# EAGLE design scheme (EAGLE 5.10)
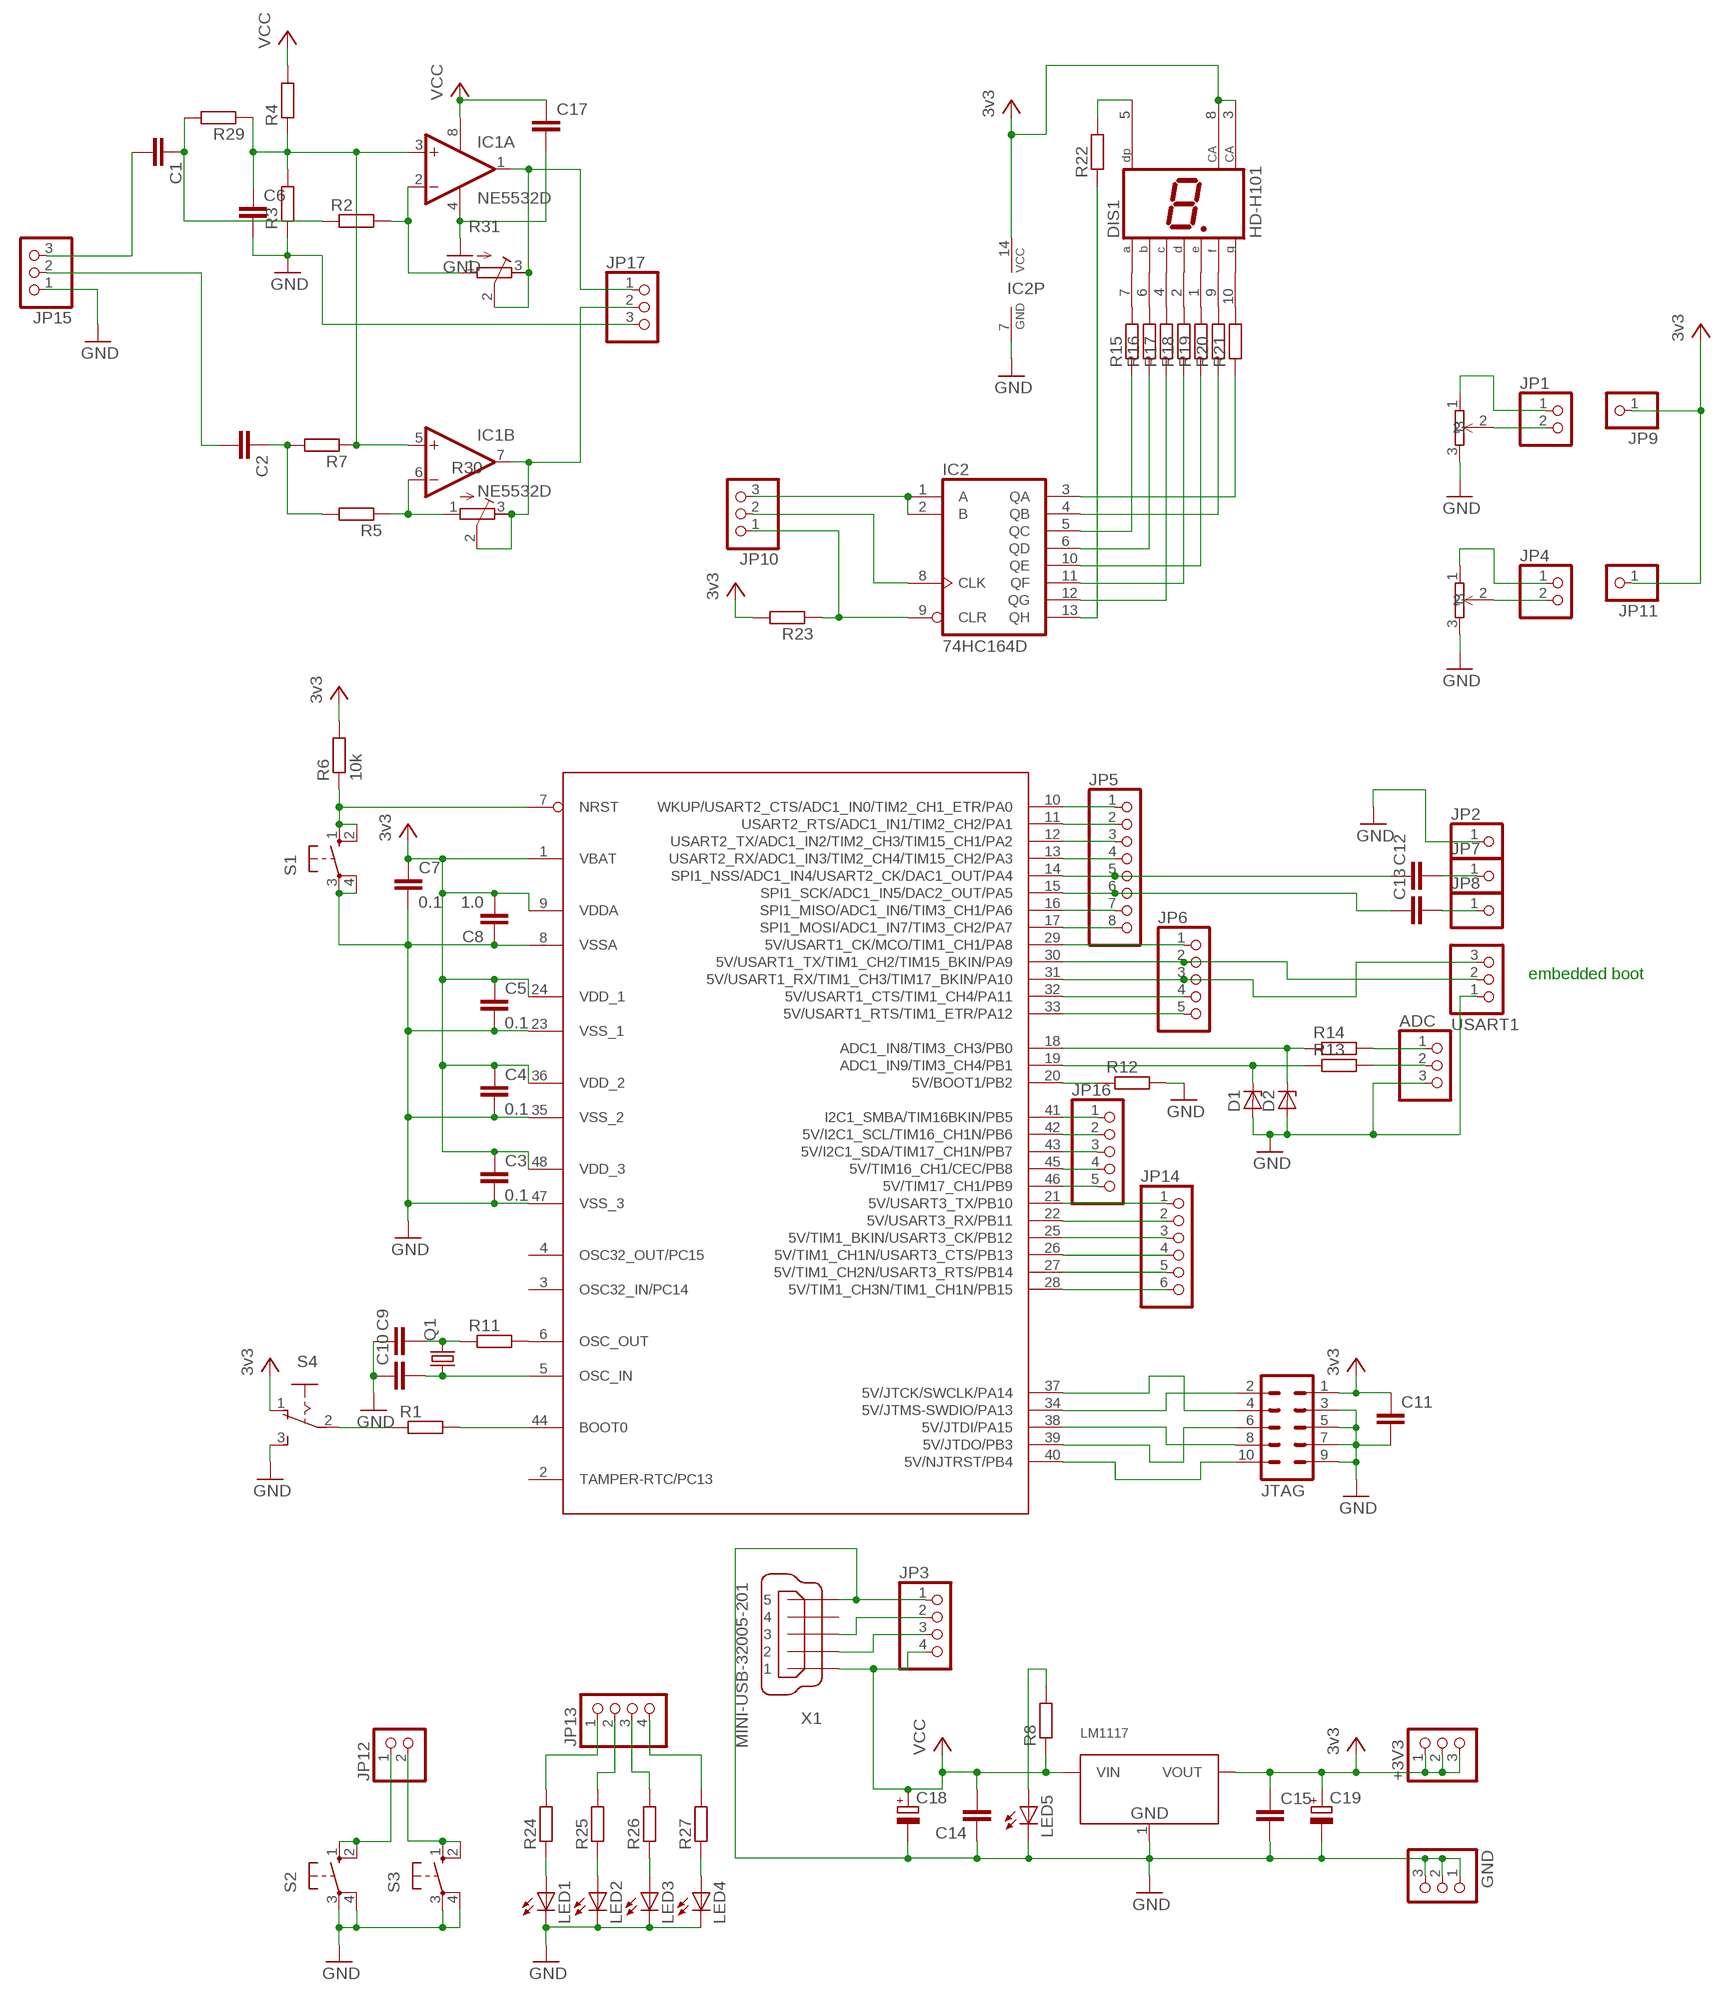
[diagram p0: schematic, sheet 1]

## Parts
+3V3  PINHD-1X3  [1X03]
ADC  PINHD-1X3  [1X03]
C1  C-EUC0805  [C0805]
C2  C-EUC0805  [C0805]
C3  0.1  C-EUC0805  [C0805]
C4  0.1  C-EUC0805  [C0805]
C5  0.1  C-EUC0805  [C0805]
C6  C-EUC0805  [C0805]
C7  0.1  C-EUC0805  [C0805]
C8  1.0  C-EUC1206  [C1206]
C9  C-EUC0805  [C0805]
C10  C-EUC0805  [C0805]
C11  C-EUC0805  [C0805]
C12  C-EUC0805  [C0805]
C13  C-EUC0805  [C0805]
C14  C-EUC1206  [C1206]
C15  C-EUC0805  [C0805]
C17  C-EUC0805  [C0805]
C18  CPOL-EUE2,5-6E  [E2,5-6E]
C19  CPOL-EUE2,5-6E  [E2,5-6E]
D1  ZENER-DIODEDO34-7  [DO34Z7]
D2  ZENER-DIODEDO34-7  [DO34Z7]
DIS1  HD-H101  [HDSP-M]
GND  PINHD-1X3  [1X03]
IC1  NE5532D  [SO08]
IC2  74HC164D  [SO14]
JP1  PINHD-1X2  [1X02]
JP2  PINHD-1X1  [1X01]
JP3  PINHD-1X4  [1X04]
JP4  PINHD-1X2  [1X02]
JP5  PINHD-1X8  [1X08]
JP6  PINHD-1X5  [1X05]
JP7  PINHD-1X1  [1X01]
JP8  PINHD-1X1  [1X01]
JP9  PINHD-1X1  [1X01]
JP10  PINHD-1X3  [1X03]
JP11  PINHD-1X1  [1X01]
JP12  PINHD-1X2  [1X02]
JP13  PINHD-1X4  [1X04]
JP14  PINHD-1X6  [1X06]
JP15  PINHD-1X3  [1X03]
JP16  PINHD-1X5  [1X05]
JP17  PINHD-1X3  [1X03]
JTAG  ML10  [ML10]
LED1  LEDCHIPLED_0805  [CHIPLED_0805]
LED2  LEDCHIPLED_0805  [CHIPLED_0805]
LED3  LEDCHIPLED_0805  [CHIPLED_0805]
LED4  LEDCHIPLED_0805  [CHIPLED_0805]
LED5  LEDCHIPLED_0805  [CHIPLED_0805]
LM1117  LD1117-3.3SOT223  [SOT223]
Q1  CRYSTALHC49U70  [HC49U70]
R1  R-EU_R0805  [R0805]
R2  R-EU_R0805  [R0805]
R3  R-EU_R0805  [R0805]
R4  R-EU_R0805  [R0805]
R5  R-EU_R0805  [R0805]
R6  10k  R-EU_R0805  [R0805]
R7  R-EU_R0805  [R0805]
R8  R-EU_R0805  [R0805]
R11  R-EU_R0805  [R0805]
R12  R-EU_R0805  [R0805]
R13  R-EU_R0805  [R0805]
R14  R-EU_R0805  [R0805]
R15  R-EU_R0805  [R0805]
R16  R-EU_R0805  [R0805]
R17  R-EU_R0805  [R0805]
R18  R-EU_R0805  [R0805]
R19  R-EU_R0805  [R0805]
R20  R-EU_R0805  [R0805]
R21  R-EU_R0805  [R0805]
R22  R-EU_R0805  [R0805]
R23  R-EU_R0805  [R0805]
R24  R-EU_R0805  [R0805]
R25  R-EU_R0805  [R0805]
R26  R-EU_R0805  [R0805]
R27  R-EU_R0805  [R0805]
R29  R-EU_R0805  [R0805]
R30  R-TRIMM64W  [RTRIM64W]
R31  R-TRIMM64W  [RTRIM64W]
S1  10-XX  [B3F-10XX]
S2  10-XX  [B3F-10XX]
S3  10-XX  [B3F-10XX]
S4  M251  [M251]
U$1  STM32F100C4T6  [LQFP48]
U$2  POT1  [POT1]
U$3  POT1  [POT1]
USART1  PINHD-1X3  [1X03]
X1  MINI-USB-32005-201  [32005-201]

## Nets
3V3: +3V3.1 +3V3.2 +3V3.3 C3.1 C4.1 C5.1 C7.1 C8.2 C11.1 C15.1 C19.+ DIS1.3(CA) DIS1.8(CA) IC2.14(VCC) JP9.1 JP11.1 JTAG.1 LM1117.2(VOUT) R6.2 R23.2 S4.1(O) U$1.1(VBAT) U$1.9(VDDA) U$1.24(VDD_1) U$1.36(VDD_2) U$1.48(VDD_3) ; supply symbol labelled 3v3
GND: ADC.3 C3.2 C4.2 C5.2 C6.2 C7.2 C8.1 C9.1 C10.1 C11.2 C14.1 C15.2 C17.2 C18.- C19.- D1.A D2.A GND.1 GND.2 GND.3 IC1.4(P:V-) IC2.7(GND) JP2.1 JP3.1 JP15.1 JP17.3 JTAG.3 JTAG.5 JTAG.7 JTAG.9 LED1.C LED2.C LED3.C LED4.C LED5.C LM1117.1(GND) R3.1 R12.2 S1.3(P) S1.4(P1) S2.3(P) S2.4(P1) S3.3(P) S3.4(P1) S4.3(S) U$1.8(VSSA) U$1.23(VSS_1) U$1.35(VSS_2) U$1.47(VSS_3) U$2.3 U$3.3 USART1.1 X1.5
N$1: C6.1 IC1.3(A:+IN) IC1.5(B:+IN) R3.2 R4.1 R7.1 R29.1
N$2: IC1.2(A:-IN) R2.2 R31.1(E)
N$3: IC1.1(A:OUT) JP17.1 R31.2(S) R31.3(A)
N$4: R11.2 U$1.6(OSC_OUT)
N$5: C2.1 R5.2 R7.2
N$6: IC1.6(B:-IN) R5.1 R30.1(E)
N$7: IC1.7(B:OUT) JP17.2 R30.2(S) R30.3(A)
N$8: R6.1 S1.1(S) S1.2(S1) U$1.7(NRST)
N$9: C10.2 Q1.1 U$1.5(OSC_IN)
N$10: C9.2 Q1.2 R11.1
N$11: C1.2 JP15.3
N$12: C2.2 JP15.2
N$13: R1.1 S4.2(P)
N$14: C13.2 JP8.1
N$15: R12.1 U$1.20(5V/BOOT1/PB2)
N$16: R1.2 U$1.44(BOOT0)
N$17: JTAG.2 U$1.34(5V/JTMS-SWDIO/PA13)
N$18: JTAG.4 U$1.37(5V/JTCK/SWCLK/PA14)
N$19: JTAG.8 U$1.38(5V/JTDI/PA15)
N$20: JTAG.6 U$1.39(5V/JTDO/PB3)
N$21: JTAG.10 U$1.40(5V/NJTRST/PB4)
N$22: C12.1 JP5.5 U$1.14(SPI1_NSS/ADC1_IN4/USART2_CK/DAC1_OUT/PA4)
N$23: C13.1 JP5.6 U$1.15(SPI1_SCK/ADC1_IN5/DAC2_OUT/PA5)
N$24: C12.2 JP7.1
N$25: JP6.3 U$1.31(5V/USART1_RX/TIM1_CH3/TIM17_BKIN/PA10) USART1.3
N$26: JP6.2 U$1.30(5V/USART1_TX/TIM1_CH2/TIM15_BKIN/PA9) USART1.2
N$27: D1.C R13.1 U$1.19(ADC1_IN9/TIM3_CH4/PB1)
N$28: D2.C R14.1 U$1.18(ADC1_IN8/TIM3_CH3/PB0)
N$29: DIS1.7(A) R15.2
N$30: ADC.1 R14.2
N$31: ADC.2 R13.2
N$32: DIS1.6(B) R16.2
N$33: DIS1.4(C) R17.2
N$34: DIS1.2(D) R18.2
N$35: DIS1.1(E) R19.2
N$36: DIS1.9(F) R20.2
N$37: DIS1.10(G) R21.2
N$38: IC2.3(QA) R21.1
N$39: DIS1.5(DP) R22.2
N$40: IC2.4(QB) R20.1
N$41: IC2.5(QC) R15.1
N$42: IC2.6(QD) R16.1
N$43: IC2.10(QE) R19.1
N$44: IC2.11(QF) R18.1
N$45: IC2.12(QG) R17.1
N$46: IC2.13(QH) R22.1
N$47: IC2.1(A) IC2.2(B) JP10.3
N$48: IC2.8(CLK) JP10.2
N$49: JP16.4 U$1.45(5V/TIM16_CH1/CEC/PB8)
N$50: JP16.5 U$1.46(5V/TIM17_CH1/PB9)
N$51: IC2.9(CLR) JP10.1 R23.1
N$52: JP12.1 S2.1(S) S2.2(S1)
N$53: JP12.2 S3.1(S) S3.2(S1)
N$54: LED4.A R27.1
N$55: LED3.A R26.1
N$56: LED2.A R25.1
N$57: LED1.A R24.1
N$58: JP13.1 R24.2
N$59: JP13.2 R25.2
N$60: JP13.3 R26.2
N$61: JP13.4 R27.2
N$62: JP5.1 U$1.10(WKUP/USART2_CTS/ADC1_IN0/TIM2_CH1_ETR/PA0)
N$63: JP5.2 U$1.11(USART2_RTS/ADC1_IN1/TIM2_CH2/PA1)
N$64: JP5.3 U$1.12(USART2_TX/ADC1_IN2/TIM2_CH3/TIM15_CH1/PA2)
N$65: JP5.4 U$1.13(USART2_RX/ADC1_IN3/TIM2_CH4/TIM15_CH2/PA3)
N$66: JP5.7 U$1.16(SPI1_MISO/ADC1_IN6/TIM3_CH1/PA6)
N$67: JP5.8 U$1.17(SPI1_MOSI/ADC1_IN7/TIM3_CH2/PA7)
N$68: JP6.1 U$1.29(5V/USART1_CK/MCO/TIM1_CH1/PA8)
N$69: JP6.4 U$1.32(5V/USART1_CTS/TIM1_CH4/PA11)
N$70: JP6.5 U$1.33(5V/USART1_RTS/TIM1_ETR/PA12)
N$71: JP1.2 U$2.2
N$72: C1.1 R2.1 R29.2
N$73: JP14.1 U$1.21(5V/USART3_TX/PB10)
N$74: JP14.2 U$1.22(5V/USART3_RX/PB11)
N$75: JP14.3 U$1.25(5V/TIM1_BKIN/USART3_CK/PB12)
N$76: JP14.4 U$1.26(5V/TIM1_CH1N/USART3_CTS/PB13)
N$77: JP14.5 U$1.27(5V/TIM1_CH2N/USART3_RTS/PB14)
N$78: JP14.6 U$1.28(5V/TIM1_CH3N/TIM1_CH1N/PB15)
N$79: JP16.1 U$1.41(I2C1_SMBA/TIM16BKIN/PB5)
N$80: JP16.2 U$1.42(5V/I2C1_SCL/TIM16_CH1N/PB6)
N$81: JP16.3 U$1.43(5V/I2C1_SDA/TIM17_CH1N/PB7)
N$82: LED5.A R8.2
N$83: JP4.2 U$3.2
N$84: JP4.1 U$3.1
N$85: JP1.1 U$2.1
N$87: JP3.3 X1.2
N$88: JP3.2 X1.3
VCC: C14.2 C17.1 C18.+ IC1.8(P:V+) JP3.4 LM1117.3(VIN) R4.2 R8.1 X1.1
Unconnected: U$1.2(TAMPER-RTC/PC13) U$1.3(OSC32_IN/PC14) U$1.4(OSC32_OUT/PC15) X1.4

## Notes on the sheet
- embedded boot

## Library data of the parts
+3V3 ADC GND JP10 JP15 JP17 USART1 = pinhead:PINHD-1X3: PIN HEADER
C1-C15 C17 = rcl:C-EU: CAPACITOR, European symbol
C18 C19 = rcl:CPOL-EU: POLARIZED CAPACITOR, European symbol
D1 D2 = diode:ZENER-DIODE: Z-Diode
DIS1 = display-hp:HD-H101: LED DISPLAY 1-character 7 segment, decimal point right
IC1 = linear:NE5532: AUDIO AMPLIFIER
IC2 = 74xx-eu:74*164: 8-bit parallel out SHIFT REGISTER
JP1 JP4 JP12 = pinhead:PINHD-1X2: PIN HEADER
JP2 JP7-JP9 JP11 = pinhead:PINHD-1X1: PIN HEADER
JP3 JP13 = pinhead:PINHD-1X4: PIN HEADER
JP5 = pinhead:PINHD-1X8: PIN HEADER
JP6 JP16 = pinhead:PINHD-1X5: PIN HEADER
JP14 = pinhead:PINHD-1X6: PIN HEADER
JTAG = con-ml:ML10: HARTING
LED1-LED5 = led:LED: LED OSRAM: - CHIPLED LG R971, LG N971, LY N971, LG Q971, LY Q971, LO R971, LY R971 LH N974, LH R974 LS Q976, LO Q976, LY Q976 LO Q996 - Hyper CHIPLED LW Q18S LB Q993, LB Q99A, LB R99A - SideLED LS A670, LO A670, LY A670, LG A670, LP A670 LB A673, LV A673, LT A673, LW A673 LH A674 LY A675 LS A676, LA A676, LO A676, LY A676, LW A676 LS A679, LY A679, LG A679 - Hyper Micro SIDELED® LS Y876, LA Y876, LO Y876, LY Y876 LT Y87S - SmartLED LW L88C, LW L88S LB L89C, LB L89S, LG L890 LS L89K, LO L89K, LY L89K LS L896, LA L896, LO L896, LY L896 - TOPLED LS T670, LO T670, LY T670, LG T670, LP T670 LSG T670, LSP T670, LSY T670, LOP T670, LYG T670 LG T671, LOG T671, LSG T671 LB T673, LV T673, LT T673, LW T673 LH T674 LS T676, LA T676, LO T676, LY T676, LB T676, LH T676, LSB T676, LW T676 LB T67C, LV T67C, LT T67C, LS T67K, LO T67K, LY T67K, LW E67C LS E67B, LA E67B, LO E67B, LY E67B, LB E67C, LV E67C, LT E67C LW T67C LS T679, LY T679, LG T679 LS T770, LO T770, LY T770, LG T770, LP T770 LB T773, LV T773, LT T773, LW T773 LH T774 LS E675, LA E675, LY E675, LS T675 LS T776, LA T776, LO T776, LY T776, LB T776 LHGB T686 LT T68C, LB T68C - Hyper Mini TOPLED® LB M676 - Mini TOPLED Santana® LG M470 LS M47K, LO M47K, LY M47K Source: http://www.osram.convergy.de LUXEON: - LUMILED® LXK2-PW12-R00, LXK2-PW12-S00, LXK2-PW14-U00, LXK2-PW14-V00 LXK2-PM12-R00, LXK2-PM12-S00, LXK2-PM14-U00 LXK2-PE12-Q00, LXK2-PE12-R00, LXK2-PE12-S00, LXK2-PE14-T00, LXK2-PE14-U00 LXK2-PB12-K00, LXK2-PB12-L00, LXK2-PB12-M00, LXK2-PB14-N00, LXK2-PB14-P00, LXK2-PB14-Q00 LXK2-PR12-L00, LXK2-PR12-M00, LXK2-PR14-Q00, LXK2-PR14-R00 LXK2-PD12-Q00, LXK2-PD12-R00, LXK2-PD12-S00 LXK2-PH12-R00, LXK2-PH12-S00 LXK2-PL12-P00, LXK2-PL12-Q00, LXK2-PL12-R00 Source: www.luxeon.com KINGBRIGHT: KA-3528ASYC Source: www.kingbright.com
LM1117 = dp_devices:LD1117-3.3
Q1 = crystal:CRYSTAL: CRYSTAL
R1-R8 R11-R27 R29 = rcl:R-EU_: RESISTOR, European symbol
R30 R31 = rcl:R-TRIMM: Trimm resistor
S1-S3 = switch-omron:10-XX: OMRON SWITCH
S4 = switch:M251: SLIDING SWITCH Mors, distributor Buerklin, 11G702
U$1 = stm32f00:STM32F100C4T6
U$2 U$3 = potentiometer:POT1
X1 = con-cypressindustries:MINI-USB-: MINI USB-B Conector Source: www.cypressindustries.com

## Board
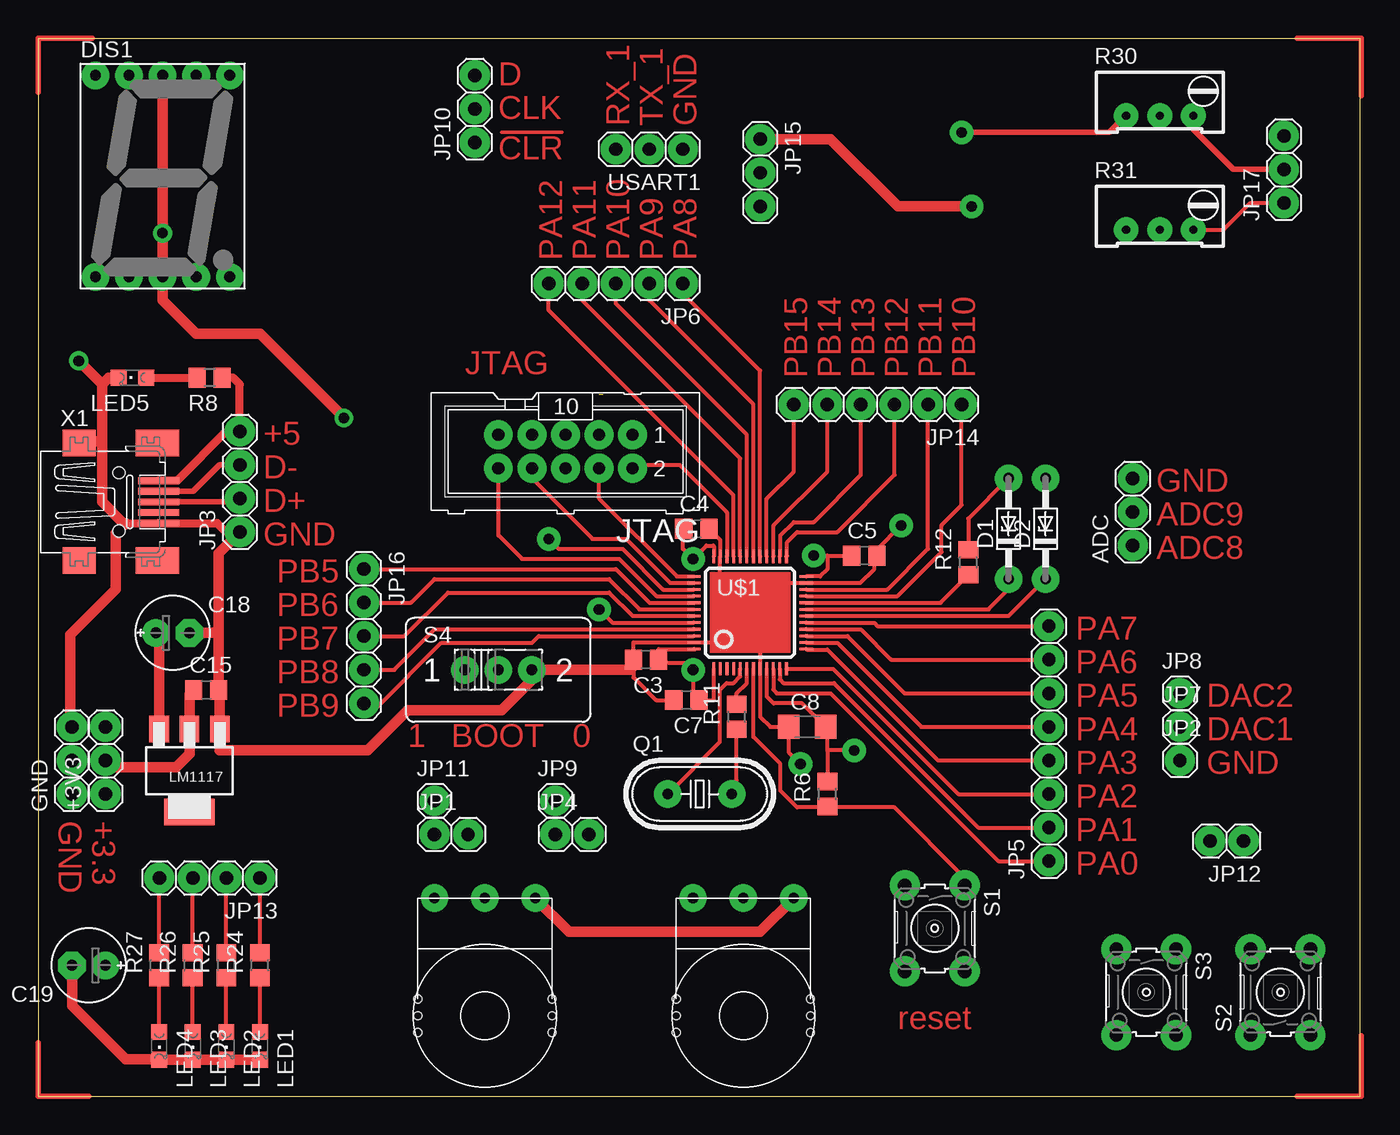
[diagram p1: board, top side]
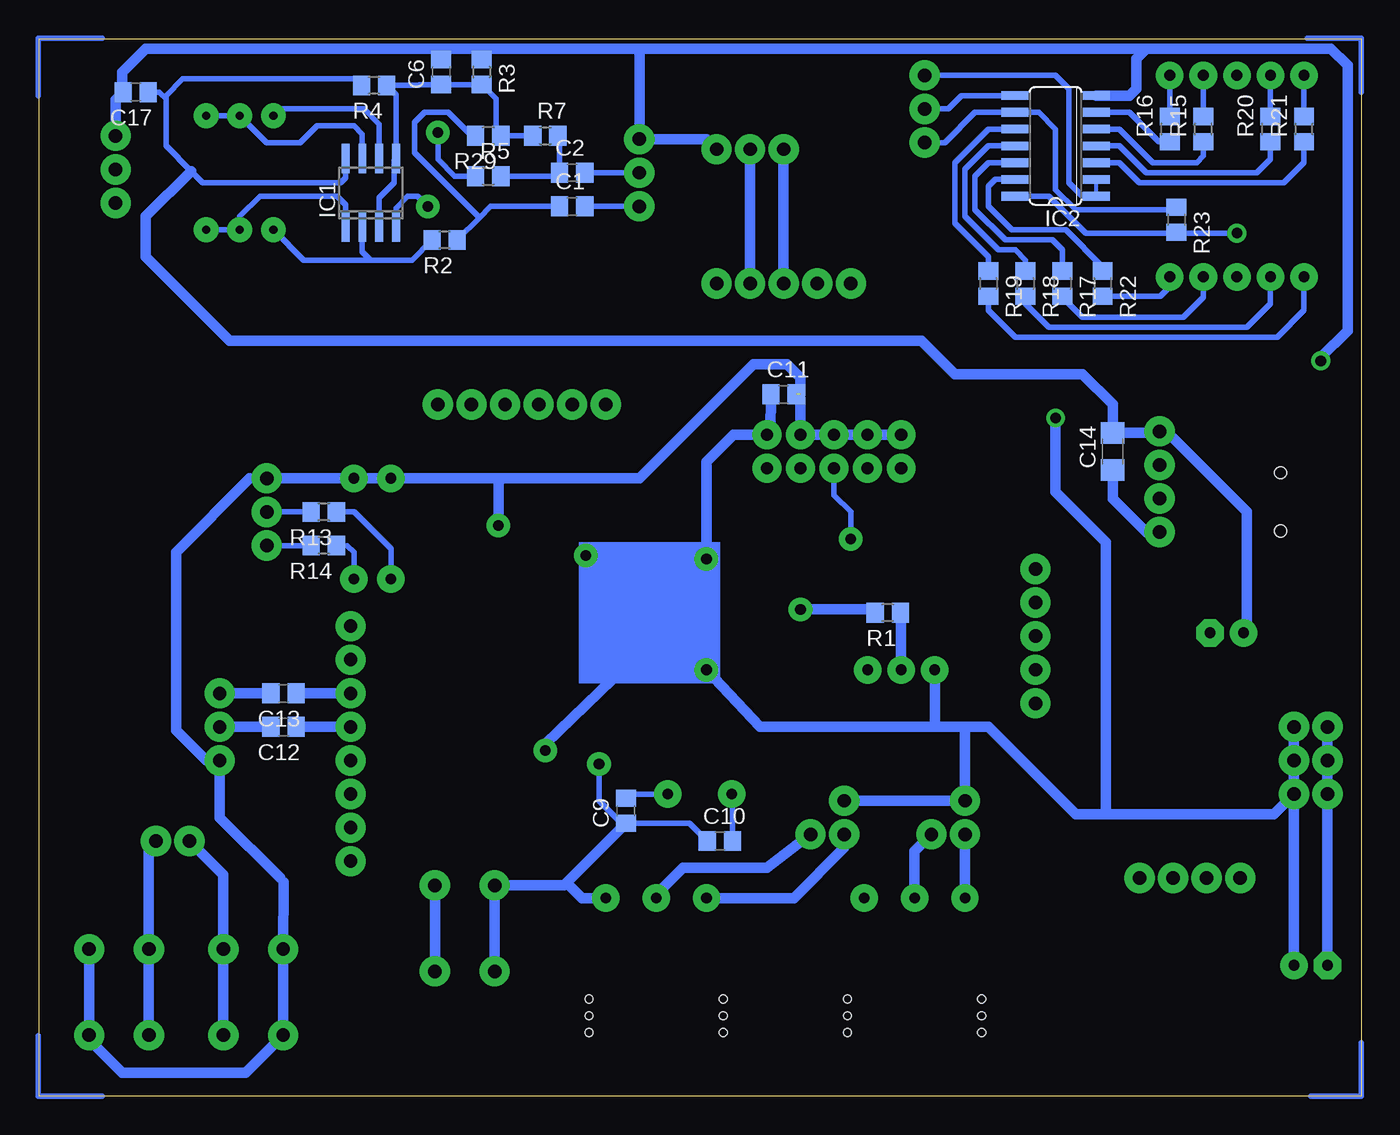
[diagram p2: board, bottom side, seen from below]

Size 100 x 80 mm. Coordinates in mm from the lower left corner, seen from the top.
Outline: 0,0 100,0 100,80 0,80 0,0
Copper layers (1*16): Top 0.035mm / dielectric 1.5mm / Bottom 0.035mm
Design rules "default": minimum track width 20mil, minimum drill 32mil, track to track 12mil, track to pad 12mil, pad to pad 12mil, via to via 12mil, smd to smd 8mil, copper to edge 40mil, drill to drill 40mil, minimum pad ring 25mil, minimum via ring 12mil, stop-mask expansion 4mil, vias tented up to drill 0mil, thermal gap 10mil

### Footprints (pad centres in the part's own frame; a part is rotated, then mirrored left to right if it is on the bottom)
1X03 = drill 1.016 round: 1 -2.54,0; 2 0,0; 3 2.54,0
C0805 = smd 1.3 x 1.5: 1 -0.95,0; 2 0.95,0
C1206 = smd 1.6 x 1.8: 1 -1.4,0; 2 1.4,0
E2,5-6E = drill 0.813 pad 1.575 round: + -1.27,0 | drill 0.813 pad 1.575 octagon: - 1.27,0
DO34Z7 = drill 0.813 round: A 3.81,0; C -3.81,0
HDSP-M = drill 0.813 round: 1 -5.08,-7.62; 2 -2.54,-7.62; 3 0,-7.62; 4 2.54,-7.62; 5 5.08,-7.62; 6 5.08,7.62; 7 2.54,7.62; 8 0,7.62; 9 -2.54,7.62; 10 -5.08,7.62
SO08 = smd 0.6 x 2.2: 1 -1.905,-2.6; 2 -0.635,-2.6; 3 0.635,-2.6; 4 1.905,-2.6; 5 1.905,2.6; 6 0.635,2.6; 7 -0.635,2.6; 8 -1.905,2.6
SO14 = smd 0.66 x 2.032: 1 -3.81,-3.073; 2 -2.54,-3.073; 3 -1.27,-3.073; 4 0,-3.073; 5 1.27,-3.073; 6 2.54,-3.073; 7 3.81,-3.073; 8 3.81,3.073; 9 2.54,3.073; 10 1.27,3.073; 11 0,3.073; 12 -1.27,3.073; 13 -2.54,3.073; 14 -3.81,3.073
1X02 = drill 1.016 round: 1 -1.27,0; 2 1.27,0
1X01 = drill 1.016 round: 1 0,0
1X04 = drill 1.016 round: 1 -3.81,0; 2 -1.27,0; 3 1.27,0; 4 3.81,0
1X08 = drill 1.016 round: 1 -8.89,0; 2 -6.35,0; 3 -3.81,0; 4 -1.27,0; 5 1.27,0; 6 3.81,0; 7 6.35,0; 8 8.89,0
1X05 = drill 1.016 round: 1 -5.08,0; 2 -2.54,0; 3 0,0; 4 2.54,0; 5 5.08,0
1X06 = drill 1.016 round: 1 -6.35,0; 2 -3.81,0; 3 -1.27,0; 4 1.27,0; 5 3.81,0; 6 6.35,0
ML10 = drill 0.914 round: 1 -5.08,-1.27; 2 -5.08,1.27; 3 -2.54,-1.27; 4 -2.54,1.27; 5 0,-1.27; 6 0,1.27; 7 2.54,-1.27; 8 2.54,1.27; 9 5.08,-1.27; 10 5.08,1.27
CHIPLED_0805 = smd 1.2 x 1.2: A 0,-1.05; C 0,1.05
SOT223 = smd 1.5 x 2: 1 -2.3,-3.15; 2 0,-3.15; 3 2.3,-3.15 | smd 3.8 x 2: 4 0,3.15
HC49U70 = drill 0.813 round: 1 -2.413,0; 2 2.413,0
R0805 = smd 1.3 x 1.5: 1 -0.95,0; 2 0.95,0
RTRIM64W = drill 0.61 round: 1 1.27,-2.54; 2 1.27,0; 3 1.27,2.54
B3F-10XX = drill 1.016 round: 1 -3.251,2.261; 2 3.251,2.261; 3 -3.251,-2.261; 4 3.251,-2.261
M251 = drill 0.813 round: 1 -2.54,0; 2 0,0; 3 2.54,0
LQFP48 = smd 0.2 x 1: 1 -2.75,-4.25; 2 -2.25,-4.25; 3 -1.75,-4.25; 4 -1.25,-4.25; 5 -0.75,-4.25; 6 -0.25,-4.25; 7 0.25,-4.25; 8 0.75,-4.25; 9 1.25,-4.25; 10 1.75,-4.25; 11 2.25,-4.25; 12 2.75,-4.25; 25 2.75,4.25; 26 2.25,4.25; 27 1.75,4.25; 28 1.25,4.25; 29 0.75,4.25; 30 0.25,4.25; 31 -0.25,4.25; 32 -0.75,4.25; 33 -1.25,4.25; 34 -1.75,4.25; 35 -2.25,4.25; 36 -2.75,4.25 | smd 1 x 0.2: 13 4.25,-2.75; 14 4.25,-2.25; 15 4.25,-1.75; 16 4.25,-1.25; 17 4.25,-0.75; 18 4.25,-0.25; 19 4.25,0.25; 20 4.25,0.75; 21 4.25,1.25; 22 4.25,1.75; 23 4.25,2.25; 24 4.25,2.75; 37 -4.25,2.75; 38 -4.25,2.25; 39 -4.25,1.75; 40 -4.25,1.25; 41 -4.25,0.75; 42 -4.25,0.25; 43 -4.25,-0.25; 44 -4.25,-0.75; 45 -4.25,-1.25; 46 -4.25,-1.75; 47 -4.25,-2.25; 48 -4.25,-2.75
POT1 = drill 0.8 round: 1 6.35,3.81; 2 6.35,0; 3 6.35,-3.81 | hole 0.6: -3.81,5.08; -2.54,5.08; -1.27,5.08; -3.81,-5.08; -2.54,-5.08; -1.27,-5.08
32005-201 = smd 3.1 x 0.5: 1 3,1.6; 2 3,0.8; 3 3,0; 4 3,-0.8; 5 3,-1.6 | smd 2.5 x 2: M1 -3,-4.45; M2 -3,4.45 | smd 3.3 x 2: M3 2.9,4.45; M4 2.9,-4.45 | hole 0.9: 0,2.2; 0,-2.2

### Placement (x,y rotation side)
+3V3  5.08,25.4 90 top
ADC  82.8,44.2 90 top
C1  59.69,67.31 0 bottom
C2  59.69,69.85 0 bottom
C3  45.97,33.02 180 top
C4  49.78,42.93 0 top
C5  62.48,40.89 0 top
C6  69.6,77.47 90 bottom
C7  49.02,29.97 180 top
C8  58.17,27.94 0 top
C9  55.63,21.59 90 bottom
C10  48.51,19.3 0 bottom
C11  43.69,53.09 0 bottom
C12  81.53,27.94 180 bottom
C13  81.53,30.48 180 bottom
C14  18.8,48.77 90 bottom
C15  12.7,30.73 0 top
C17  92.71,75.95 180 bottom
C18  10.16,35.05 0 top
C19  3.81,9.91 180 top
D1  73.41,42.93 90 top
D2  76.2,42.93 90 top
DIS1  9.4,69.6 0 top
GND  2.54,25.4 90 top
IC1  74.93,68.33 0 bottom
IC2  23.11,71.88 90 bottom
JP1  31.24,19.81 0 top
JP2  86.36,25.4 0 top
JP3  15.24,46.48 90 top
JP4  40.39,19.81 0 top
JP5  76.45,26.67 90 top
JP6  43.69,61.47 180 top
JP7  86.36,27.94 0 top
JP8  86.36,30.48 0 top
JP9  39.12,22.35 0 top
JP10  33.02,74.68 90 top
JP11  29.97,22.35 0 top
JP12  89.92,19.3 180 top
JP13  12.95,16.51 180 top
JP14  63.5,52.32 180 top
JP15  54.61,69.85 270 top
JP16  24.64,34.8 270 top
JP17  94.23,70.1 90 top
JTAG  39.88,48.77 180 top
LED1  16.76,3.81 180 top
LED2  14.22,3.81 180 top
LED3  11.68,3.81 180 top
LED4  9.14,3.81 180 top
LED5  7.11,54.36 90 top
LM1117  11.43,24.64 180 top
Q1  50.04,22.86 0 top
R1  35.81,36.58 180 bottom
R2  69.34,64.77 180 bottom
R3  66.55,77.47 270 bottom
R4  74.68,76.45 180 bottom
R5  66.04,69.6 0 bottom
R6  59.69,22.86 90 top
R7  61.72,72.64 0 bottom
R8  12.95,54.36 180 top
R11  52.83,28.7 90 top
R12  70.36,40.39 90 top
R13  78.49,44.2 180 bottom
R14  78.49,41.66 180 bottom
R15  11.94,73.15 90 bottom
R16  14.48,73.15 90 bottom
R17  22.61,61.47 270 bottom
R18  25.4,61.47 270 bottom
R19  28.19,61.47 270 bottom
R20  6.86,73.15 90 bottom
R21  4.32,73.15 90 bottom
R22  19.56,61.47 270 bottom
R23  13.97,66.29 270 bottom
R24  16.76,9.91 90 top
R25  14.22,9.91 90 top
R26  11.68,9.91 90 top
R27  9.14,9.91 90 top
R29  66.04,72.64 180 bottom
R30  84.84,75.44 270 top
R31  84.84,66.8 270 top
S1  67.82,12.7 270 top
S2  93.98,7.87 90 top
S3  83.82,7.87 270 top
S4  34.8,32.26 0 top
U$1  53.85,36.58 0 top
U$2  33.78,8.64 90 top
U$3  53.34,8.64 90 top
USART1  46.23,71.63 180 top
X1  6.1,44.96 0 top

### Tracks (layer width: path | path; a pad name or v marks a point on that pad's centre or on a via)
3V3  (via drill 0.6, 0.8, 0.8 pad 1.78)
  Top 0.305: U$1.1 51.1,29.97 C7.1 49.53,30.41 v49.53,32.26 49.53,32.77 47.69,32.77 C3.1 46.92,33.83 U$1.48 49.64,33.78 | U$1.9 55.12,32.31 55.12,30.23 55.63,29.72 57.79,29.72 C8.2 59.69,27.82 59.69,26.16 | 59.69,26.16 R6.2 | C4.1 48.77,42.86 48.77,41.4 v49.53,40.64 50.55,41.66 51.05,41.66 51.1,41.61 U$1.36 | U$1.24 59.14,39.33 59.69,39.88 59.69,40.89 | v58.67,40.89 59.69,40.89 | 59.69,40.89 C5.1 | v61.72,26.16 59.69,26.16 | +3V3.3 5.21,28.07
  Top 0.813: v23.11,51.31 16.76,57.66 11.94,57.66 9.4,60.2 DIS1.3 v9.4,65.28 DIS1.8 | C15.1 11.43,30.41 LM1117.2 11.43,25.91 10.41,24.89 5.59,24.89 +3V3.2
  Bottom 0.305: v58.67,40.89 50.04,40.89 v49.53,40.64 v49.53,32.26 55.63,32.51 | JTAG.1 44.89,50.04 | 29.97,27.94 32.26,28.19
  Bottom 0.406: v9.4,65.28 13.9,65.28 R23.2 14.04,65.28 20.83,65.28 23.62,68.07 IC2.14
  Bottom 0.813: C11.1 44.7,50.23 44.89,50.04 | v61.72,26.16 61.72,26.67 55.63,32.51 | v49.53,32.26 45.47,27.94 29.97,27.94 | 29.97,27.94 28.19,27.94 21.59,21.34 19.3,21.34 | 19.3,21.34 6.6,21.34 +3V3.1 | 32.26,28.19 S4.1 | 19.3,21.34 19.3,41.91 23.11,45.72 v23.11,51.31 | 29.97,27.94 JP11.1 JP9.1 | +3V3.1 +3V3.2 +3V3.3 | C19.+ +3V3.1 | JTAG.1 47.5,50.04 49.53,48.01 v49.53,40.64
GND  (via drill 0.8, 0.8 pad 1.78)  (1 unrouted)
  Top 0.305: U$1.47 45.02,34.33 C3.2 45.02,32.51 45.02,31.68 46.74,29.97 C7.2 | U$1.47 53.81,34.33 54.61,33.53 U$1.8 54.6,28.71 55.37,27.94 C8.1 56.77,26.04 v57.66,25.15 | U$1.47 51.53,34.33 51.56,34.29 51.56,38.61 | 51.56,38.61 51.56,40.79 U$1.35 51.6,42.06 C4.2 | 51.56,38.61 51.78,38.83 U$1.23 62.19,38.83 63.25,39.88 63.25,40.45 C5.2 63.43,41.34 v65.28,43.18 | R12.2 70.36,43.69 D1.A | 6.6,43.36 6.43,43.36 | 5.33,54.36 LED5.C
  Top 0.61: JP3.1 14.22,42.67 13.54,43.36 X1.5 6.6,43.36
  Top 0.813: LED1.C LED2.C LED3.C LED4.C 9.11,2.79 6.6,2.79 2.54,6.86 C19.- | v70.61,67.31 65.02,67.31 59.94,72.39 JP15.1 | 6.43,43.36 4.83,44.96 4.83,49.53 | 4.83,49.53 4.83,53.85 | 4.83,53.85 5.33,54.36 | 4.83,49.53 3.05,49.53 | JP3.1 13.65,41.08 13.65,35.31 | 6.6,43.36 5.84,42.6 5.84,38.35 2.41,34.92 2.41,28.07 GND.3 | 4.83,53.85 v3.05,55.63 | 45.02,32.51 44.77,32.26 S4.3 37.34,31.5 35.05,29.21 27.94,29.21 24.89,26.16 13.72,26.16 13.72,27.77 LM1117.1 13.73,30.65 C15.2 | U$2.3 40.13,12.45 54.61,12.45 U$3.3 | C15.2 13.72,30.67 | 13.65,35.31 C15.2 | C18.- 13.4,35.05 13.65,35.31
  Bottom 0.305: C9.1 55.69,20.57 55.88,20.57 | 42.42,52.77 C11.2 | 81.79,16.51 81.53,16.18 | S2.4 S2.3 | v3.05,55.63 3.05,55.88 | 60.1,16.16 60.31,15.95 | ADC.3 84.07,46.74
  Bottom 0.406: C10.1 50.8,20.64 C9.1 | JP15.1 54.61,72.64 | R3.1 66.48,78.49 | IC1.4 73.03,67.18 72.14,68.07 71.37,68.07 v70.61,67.31 | 55.88,20.57 57.66,22.35 v57.66,25.15
  Bottom 0.813: 42.42,52.77 JTAG.3 JTAG.5 JTAG.7 JTAG.9 | 81.79,16.51 86.36,21.08 JP2.1 87.38,25.4 89.66,27.69 89.66,41.15 84.07,46.74 | 81.53,16.18 S3.3 S3.4 84.4,1.78 93.73,1.78 96.24,4.29 S2.4 | ADC.3 D2.A D1.A 65.02,46.74 | 16.26,79.25 17.02,78.49 17.02,76.2 17.53,75.69 IC2.7 | 16.26,79.25 2.29,79.25 1.02,77.98 1.02,57.91 3.05,55.88 | JP3.1 16.26,42.67 18.8,45.21 C14.1 | JP17.3 94.23,75.37 C17.2 93.73,76.01 93.73,77.47 91.95,79.25 69.85,79.25 | 42.42,53.09 42.42,54.36 43.43,55.37 45.97,55.37 54.61,46.74 65.02,46.74 | USART1.1 49.53,72.39 JP15.1 54.61,79.25 | 60.31,15.95 S1.3 S1.4 | C9.1 60.1,16.16 58.93,14.99 U$3.3 | GND.3 GND.2 GND.1 C19.- | 16.26,79.25 54.61,79.25 | 54.61,79.25 66.55,79.25 | 66.55,79.25 69.85,79.25 | 66.55,79.25 R3.1 | C6.2 69.6,78.99 69.85,79.25 | v65.28,43.18 65.28,46.48 65.02,46.74
N$1
  Bottom 0.406: IC1.3 74.3,67.94 73.15,69.09 73.15,70.8 IC1.5 73.03,75.75 R4.1 71.32,76.45 71.25,76.52 C6.1 R3.2 65.47,75.44 65.47,73.02 R29.1 R7.1
N$2
  Bottom 0.406: IC1.2 75.56,63.88 74.93,63.25 | 74.93,63.25 71.82,63.25 R2.2 | 74.93,63.25 80.01,63.25 R31.1
N$3
  Top 0.305: R31.3 89.66,65.53 91.69,67.56 JP17.1
  Bottom 0.406: IC1.1 76.83,67.44 77.47,68.07 83.31,68.07 84.84,66.55 R31.2 R31.3
N$4
  Top 0.305: R11.2 52.83,30.48 53.59,31.24 U$1.6
N$5
  Bottom 0.406: R7.2 60.64,72.51 C2.1 60.89,69.6 R5.2
N$6  (via drill 0.8 pad 1.78)
  Top 0.406: v69.85,72.9 81.03,72.9 R30.1
  Bottom 0.406: R5.1 68.58,69.6 69.85,70.87 v69.85,72.9 | IC1.6 74.3,73.53 75.44,74.68 81.79,74.68 R30.1
N$7
  Top 0.406: R30.3 87.38,73.15 90.42,70.1 JP17.2
  Bottom 0.406: IC1.7 75.56,72.77 76.2,73.41 78.99,73.41 80.26,72.14 82.8,72.14 R30.2 R30.3
N$8
  Top 0.305: U$1.7 54.1,27.18 56.13,25.15 56.13,23.11 57.4,21.84 59.62,21.84 R6.1 59.76,21.84 64.77,21.84 70.08,16.54 S1.1
  Bottom 0.813: S1.2 S1.1
N$9
  Top 0.305: 53.09,32.33 U$1.5 53.09,32.31 53.09,31.75 52.58,31.24 52.07,31.24 51.56,30.73 51.56,26.8 Q1.1
  Bottom 0.305: 47.56,23.31 Q1.1
  Bottom 0.406: C10.2 47.56,23.31
N$10
  Top 0.305: R11.1 52.83,23.88 52.45,23.5 Q1.2
  Bottom 0.305: C9.2 56.07,22.86
  Bottom 0.406: 56.07,22.86 Q1.2
N$11
  Bottom 0.406: JP15.3 C1.2
N$12
  Bottom 0.406: JP15.2 C2.2
N$13
  Bottom 0.406: 34.8,36.58 R1.1
  Bottom 0.813: S4.2 34.8,36.58
N$14
  Bottom 0.813: C13.2 JP8.1
N$15
  Top 0.305: U$1.20 68.25,37.33 R12.1
N$16  (via drill 0.8 pad 1.78)
  Top 0.305: U$1.44 43.42,35.83 v42.42,36.83
  Bottom 0.305: R1.2 36.76,36.83
  Bottom 0.813: 36.76,36.83 v42.42,36.83
N$17
  Top 0.305: U$1.34 52.1,44.17 48.51,47.75 45.21,47.75 JTAG.2
N$18
  Top 0.305: U$1.37 48.3,39.33 42.42,45.21 JTAG.4
N$19
  Top 0.305: U$1.38 47.79,38.83 44.45,42.16 41.91,42.16 37.34,46.74 JTAG.8
N$20  (via drill 0.8 pad 1.78)
  Top 0.305: U$1.39 47.27,38.33 44.2,41.4 39.37,41.4 v38.61,42.16
  Bottom 0.406: v38.61,42.16 38.61,44.2 39.88,45.47 JTAG.6
N$21
  Top 0.305: U$1.40 46.76,37.83 43.94,40.64 36.58,40.64 34.8,42.42 JTAG.10
N$22
  Top 0.305: JP5.5 66.8,27.94 60.45,34.29 58.13,34.29 U$1.14
  Bottom 0.813: JP5.5 C12.1
N$23
  Top 0.305: JP5.6 65.53,30.48 61.21,34.8 58.13,34.8 U$1.15
  Bottom 0.813: JP5.6 C13.1
N$24
  Bottom 0.813: C12.2 JP7.1
N$25
  Top 0.305: U$1.31 53.6,50.03 43.69,59.94 JP6.3
  Bottom 0.813: JP6.3 USART1.3
N$26
  Top 0.305: U$1.30 54.1,52.33 46.23,60.2 JP6.2
  Bottom 0.813: JP6.2 USART1.2
N$27
  Top 0.305: U$1.19 71.88,36.83 73.41,38.35 D1.C
  Bottom 0.406: D1.C 73.41,41.4 76.2,44.2 R13.1
N$28
  Top 0.305: U$1.18 73.41,36.33 D2.C
  Bottom 0.305: 76.71,41.66 R14.1
  Bottom 0.406: D2.C 76.2,41.15 76.71,41.66
N$29
  Bottom 0.406: R15.2 DIS1.7
N$30
  Bottom 0.406: R14.2 ADC.1
N$31
  Bottom 0.406: R13.2 ADC.2
N$32
  Bottom 0.406: R16.2 DIS1.6
N$33
  Bottom 0.406: R17.2 22.61,60.45 21.08,58.93 13.46,58.93 11.94,60.45 DIS1.4
N$34
  Bottom 0.406: R18.2 25.4,59.94 23.62,58.17 8.64,58.17 6.86,59.94 DIS1.2
N$35
  Bottom 0.406: R19.2 28.19,59.44 26.16,57.4 6.35,57.4 4.32,59.44 DIS1.1
N$36
  Bottom 0.406: R20.2 DIS1.9
N$37
  Bottom 0.406: R21.2 DIS1.10
N$38
  Bottom 0.406: IC2.3 18.29,70.61 16.76,69.09 5.84,69.09 4.32,70.61 R21.1
N$39
  Bottom 0.406: R22.2 15.17,60.52 14.48,61.21 DIS1.5
N$40
  Bottom 0.406: IC2.4 18.29,71.88 16.26,69.85 7.87,69.85 6.86,70.87 R20.1
N$41
  Bottom 0.406: IC2.5 18.29,73.15 15.75,70.61 12.45,70.61 11.94,71.12 R15.1
N$42
  Bottom 0.406: R16.1 15.31,72.2 17.53,74.42 IC2.6
N$43
  Bottom 0.406: R19.1 28.19,63.5 30.73,66.04 30.73,70.61 28.19,73.15 IC2.10
N$44
  Bottom 0.406: R18.1 25.4,63.25 26.16,64.01 27.43,64.01 29.97,66.55 29.97,70.1 28.19,71.88 IC2.11
N$45
  Bottom 0.406: R17.1 22.61,64.01 23.37,64.77 26.92,64.77 29.21,67.06 29.21,69.6 28.19,70.61 IC2.12
N$46
  Bottom 0.406: IC2.13 27.69,69.34 28.19,68.83 28.19,67.31 26.42,65.53 22.35,65.53 19.56,62.74 R22.1
N$47
  Bottom 0.305: IC2.1 IC2.2
  Bottom 0.406: IC2.1 21.08,68.07 22.1,69.09 22.1,76.2 23.11,77.22 JP10.3
N$48
  Bottom 0.406: JP10.2 31.24,74.68 30.23,75.69 IC2.8
N$49
  Top 0.305: U$1.45 49.58,35.31 29.97,35.31 26.92,32.26 JP16.4
N$50
  Top 0.305: U$1.46 49.57,34.8 37.85,34.8 37.34,34.29 30.48,34.29 25.65,29.46 24.89,29.46 JP16.5
N$51
  Bottom 0.406: R23.1 14.16,67.06 21.59,67.06 23.11,68.58 23.11,73.15 24.38,74.42 IC2.9 29.21,74.42 31.5,72.14 JP10.1
N$52
  Bottom 0.305: 91.72,18.77 JP12.1
  Bottom 0.813: S2.1 S2.2 91.72,18.77
N$53
  Bottom 0.813: S3.2 S3.1 86.08,16.74 JP12.2
N$54
  Top 0.305: LED4.A R27.1
N$55
  Top 0.305: LED3.A R26.1
N$56
  Top 0.305: LED2.A R25.1
N$57
  Top 0.305: LED1.A R24.1
N$58
  Top 0.305: R24.2 JP13.1
N$59
  Top 0.305: R25.2 JP13.2
N$60
  Top 0.305: R26.2 JP13.3
N$61
  Top 0.305: R27.2 JP13.4
N$62
  Top 0.305: U$1.10 55.6,30.76 55.88,30.48 59.94,30.48 72.64,17.78 JP5.1
N$63
  Top 0.305: U$1.11 56.1,31.53 56.39,31.24 60.2,31.24 71.12,20.32 JP5.2
N$64
  Top 0.305: JP5.3 69.6,22.86 60.13,32.33 U$1.12
N$65
  Top 0.305: JP5.4 68.07,25.4 59.69,33.78 58.14,33.78 U$1.13
N$66
  Top 0.305: JP5.7 64.52,33.02 62.23,35.31 58.12,35.31 U$1.16
N$67
  Top 0.305: JP5.8 63.5,35.56 63.25,35.81 58.11,35.81 U$1.17
N$68
  Top 0.305: U$1.29 54.6,54.88 48.77,60.71 JP6.1
N$69
  Top 0.305: U$1.32 53.1,48.25 41.15,60.2 JP6.4
N$70
  Top 0.305: JP6.5 38.61,59.44 52.58,45.47 52.58,40.85 U$1.33
N$71
  Bottom 0.813: U$2.2 33.78,18.54 JP1.2
N$72
  Bottom 0.406: R29.2 67.31,72.64 69.09,74.42 70.87,74.42 71.63,73.66 71.63,71.37 66.71,66.45 | C1.1 65.85,67.31 66.71,66.45 | 66.71,66.45 R2.1
N$73
  Top 0.305: U$1.21 65,37.83 68.33,41.15 68.33,43.18 69.85,44.7 JP14.1
N$74
  Top 0.305: U$1.22 64.23,38.33 67.31,41.4 JP14.2
N$75
  Top 0.305: U$1.25 56.64,40.87 56.64,41.91 57.4,42.67 60.45,42.67 64.77,46.99 JP14.3
N$76
  Top 0.305: U$1.26 56.13,40.86 56.13,42.42 57.15,43.43 58.67,43.43 62.23,46.99 JP14.4
N$77
  Top 0.305: U$1.27 55.63,40.85 55.63,43.18 59.69,47.24 JP14.5
N$78
  Top 0.305: U$1.28 55.1,45.19 57.15,47.24 JP14.6
N$79
  Top 0.305: U$1.41 46.24,37.33 43.69,39.88 JP16.1
N$80
  Top 0.305: U$1.42 45.47,36.83 43.18,39.12 29.97,39.12 28.19,37.34 JP16.2
N$81
  Top 0.305: U$1.43 44.95,36.33 43.18,38.1 30.99,38.1 27.69,34.8 JP16.3
N$82
  Top 0.61: LED5.A R8.2
N$83
  Bottom 0.305: 53.34,15.24 U$3.2
  Bottom 0.813: 53.34,15.24 51.31,17.27 44.96,17.27 JP4.2
N$84
  Bottom 0.305: 39.12,18.8 JP4.1
  Bottom 0.813: U$3.1 42.93,14.99 39.12,18.8
N$85
  Bottom 0.813: U$2.1 JP1.1
N$86
  Top 0.254: 35.05,72.9 39.62,72.9
N$87
  Top 0.406: X1.2 11.72,45.76 13.72,47.75 JP3.3
N$88
  Top 0.406: X1.3 14.99,44.96 JP3.2
N$89
  Top 0.406: 0,4.06 0,0 3.81,0
N$90
  Top 0.406: 95.25,0 100.08,0 100.08,4.57
N$91
  Top 0.406: 95.25,80.01 100.08,80.01 100.08,75.69
N$92
  Top 0.406: 0,75.95 0,80.01 4.06,80.01
N$93
  Bottom 0.406: 0,75.95 0,80.01 4.06,80.01
N$94
  Bottom 0.406: 0,4.06 0,0 3.81,0
N$95
  Bottom 0.406: 95.25,0 100.08,0 100.08,4.57
N$96
  Bottom 0.406: 95.25,80.01 100.08,80.01 100.08,75.69
VCC
  Top 0.305: LM1117.3 9.13,26.68
  Top 0.61: X1.1 10.49,46.56 14.22,50.29 JP3.4 15.24,53.85 14.73,54.36 R8.1
  Top 0.813: LM1117.3 9.13,34.81 C18.+
  Bottom 0.305: JP3.4 15.36,50.17
  Bottom 0.406: IC1.8 76.83,69.47 77.22,69.09 87.63,69.09 88.52,69.98 90.42,71.88 90.42,75.44 | 90.42,75.44 90.42,75.69 89.15,76.96 76.13,76.96 R4.2 | C17.1 90.93,75.95 90.42,75.44
  Bottom 0.813: 15.36,50.17 C14.2 18.8,52.32 21.08,54.61 30.73,54.61 33.27,57.15 85.6,57.15 91.95,63.5 91.95,66.55 88.52,69.98 | JP3.4 14.73,50.29 8.64,44.2 8.64,35.31 C18.+
(copper drawn outside any net)
  shapes: Bottom area x1, Top area x1

### Text on the board
Top: D | CLK | RX_1 | TX_1 | GND | CLR | PA12 | PA11 | PA10 | PA9 | PA8 | JTAG | PB15 | PB14 | PB13 | PB12 | PB11 | PB10 | +5 | D- | GND | D+ | ADC9 | GND | ADC8 | PB5 | PB6 | PA7 | PB7 | PA6 | PB8 | PB9 | PA5 | DAC2 | PA4 | DAC1 | 1 | BOOT | 0 | PA3 | GND | PA2 | GND | +3.3 | PA1 | PA0 | reset